# EAGLE design v0.3 (EAGLE 7.5.0)

## Sheet 1 of 2
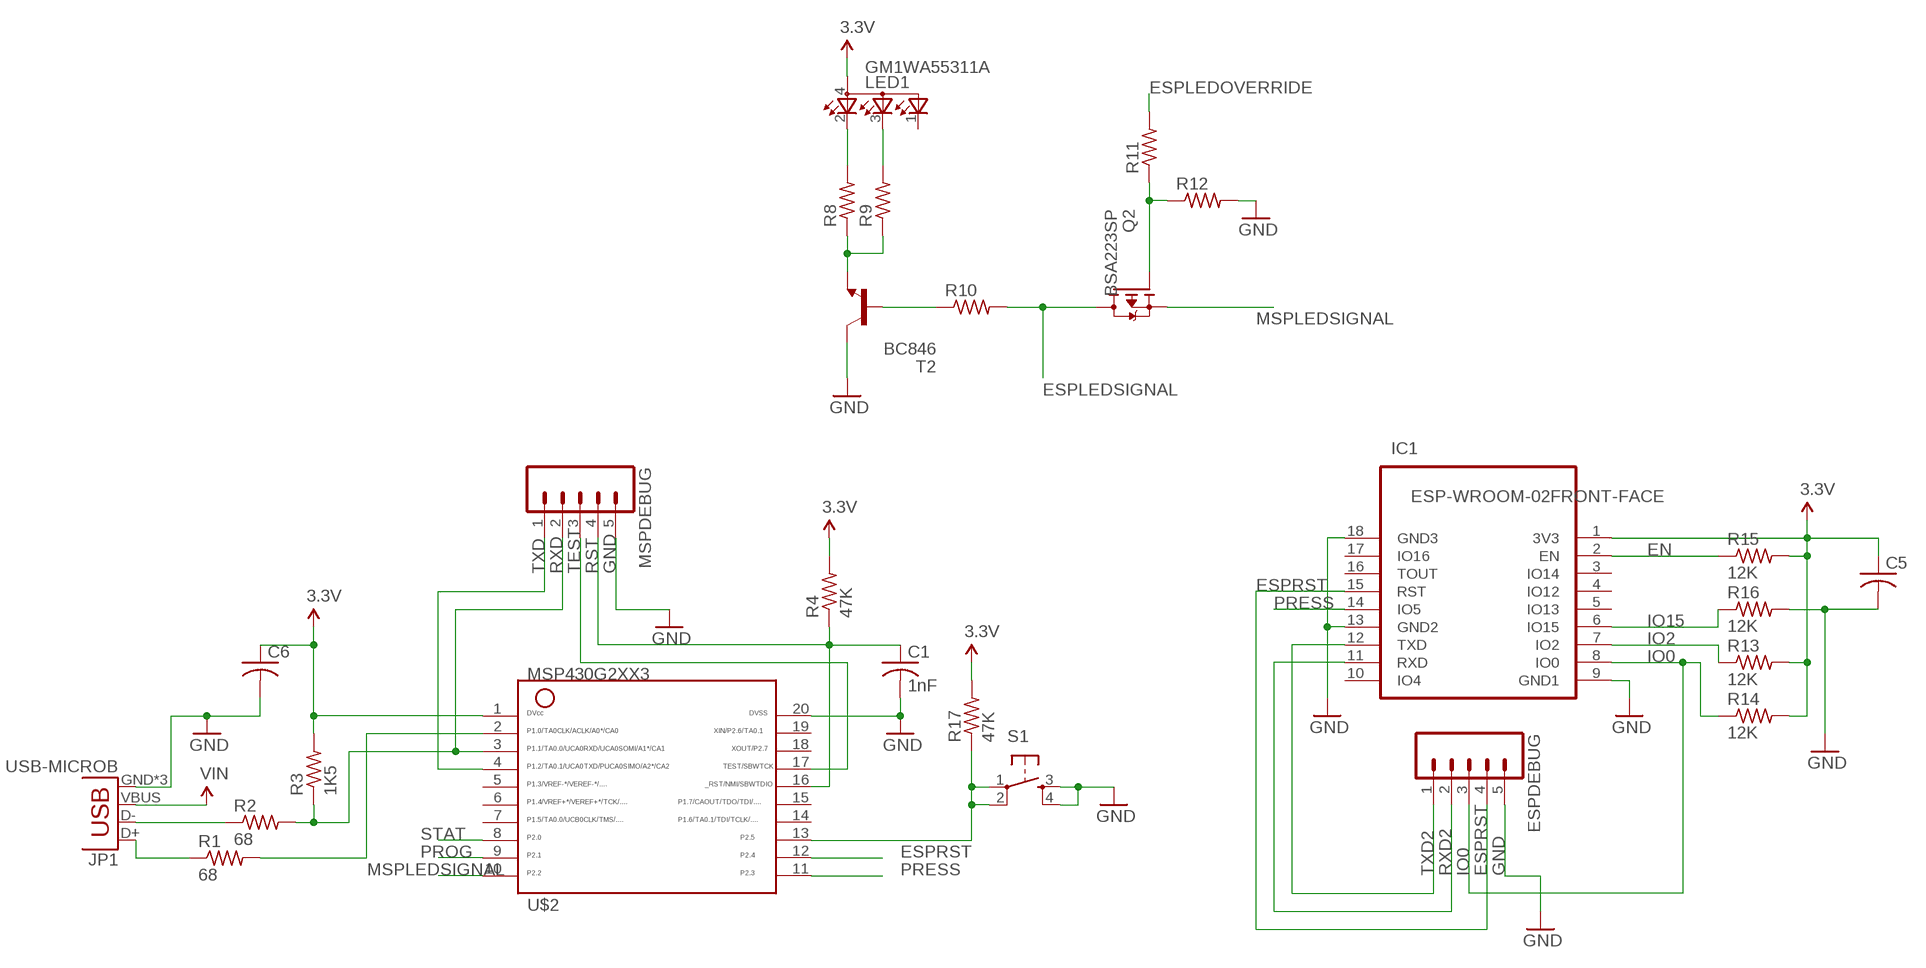
[diagram p0: schematic, sheet 1]

### Parts
C1  1nF  C-USC0603K  [C0603K]
C5  C-USC0603K  [C0603K]
C6  C-USC0603K  [C0603K]
ESPDEBUG  M05LOCK  [1X05_LOCK]
IC1  ESP-WROOM-02FRONT-FACE  [FRONT-FACE]
JP1  USB-MICROB  [USB-MICROB]
LED1  GM1WA55311A  [GM1WA55311A]
MSPDEBUG  M05LOCK  [1X05_LOCK]
Q2  BSA223SP  [SC75_INFINEON]
R1  68  R-US_R0603  [R0603]
R2  68  R-US_R0603  [R0603]
R3  1K5  R-US_R0603  [R0603]
R4  47K  R-US_R0603  [R0603]
R8  R-US_R0603  [R0603]
R9  R-US_R0603  [R0603]
R10  R-US_R0603  [R0603]
R11  R-US_R0603  [R0603]
R12  R-US_R0603  [R0603]
R13  12K  R-US_R0603  [R0603]
R14  12K  R-US_R0603  [R0603]
R15  12K  R-US_R0603  [R0603]
R16  12K  R-US_R0603  [R0603]
R17  47K  R-US_R0603  [R0603]
S1  TAC_SWITCHPTH  [TACTILE-PTH]
T2  BC846  [SOT23]
U$2  G2XX3---PW20  [PW20]

### Nets
3.3V: C5.1 C6.1 IC1.1(3V3) LED1.4(A) R3.2 R4.2 R13.2 R14.2 R15.2 R17.2 U$2.1 ; also sheet 2
EN: IC1.2(EN) R15.1
ESPLEDOVERRIDE: R11.2
ESPLEDSIGNAL: Q2.2(D) R10.2
ESPRST: ESPDEBUG.4 IC1.15(RST) U$2.12
GND: C1.2 C5.2 C6.2 ESPDEBUG.5 IC1.9(GND1) IC1.13(GND2) IC1.18(GND3) JP1.GND JP1.MT1(GND) JP1.MT2(GND) MSPDEBUG.5 R12.2 R16.2 S1.3 S1.4 T2.3(C) U$2.20 ; also sheet 2
IO0: ESPDEBUG.3 IC1.8(IO0) R14.1
IO2: IC1.7(IO2) R13.1
IO15: IC1.6(IO15) R16.1
MSPLEDSIGNAL: Q2.3(S) U$2.10
N$2: JP1.D+ R1.1
N$3: JP1.D- R2.1
N$4: R1.2 U$2.2
N$10: R17.1 S1.1 S1.2 U$2.13
N$13: LED1.2(CRED) R8.2
N$14: LED1.3(CBLUE) R9.2
N$15: R10.1 T2.1(B)
N$16: R8.1 R9.1 T2.2(E)
N$18: Q2.1(G) R11.1 R12.1
PRESS: IC1.14(IO5) U$2.11
PROG: U$2.9 ; also sheet 2
RST: C1.1 MSPDEBUG.4 R4.1 U$2.16
RXD: MSPDEBUG.2 R2.2 R3.1 U$2.3
RXD2: ESPDEBUG.2 IC1.11(RXD)
STAT: U$2.8 ; also sheet 2
TEST: MSPDEBUG.3 U$2.17
TXD: MSPDEBUG.1 U$2.4
TXD2: ESPDEBUG.1 IC1.12(TXD)
VIN: JP1.VBUS ; also sheet 2
Unconnected: IC1.3(IO14) IC1.4(IO12) IC1.5(IO13) IC1.10(IO4) IC1.16(TOUT) IC1.17(IO16) LED1.1(CGREEN) U$2.5 U$2.6 U$2.7 U$2.14 U$2.15 U$2.18 U$2.19

## Sheet 2 of 2
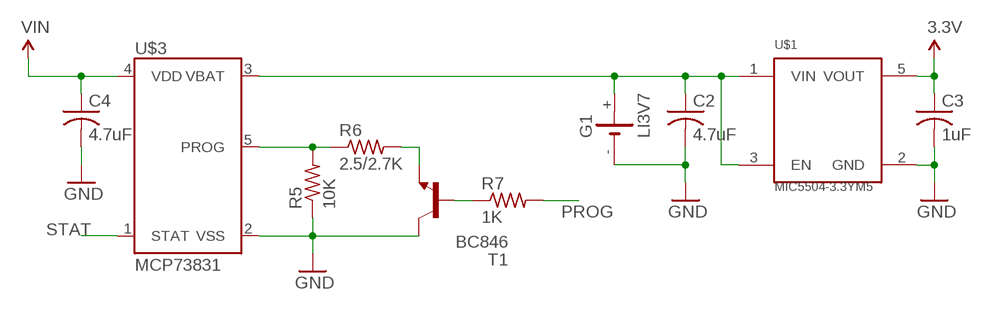
[diagram p1: schematic, sheet 2]

### Parts
C2  4.7uF  C-USC0603K  [C0603K]
C3  1uF  C-USC0603K  [C0603K]
C4  4.7uF  C-USC0603K  [C0603K]
G1  LI3V7  [LI3V7]
R5  10K  R-US_R0603  [R0603]
R6  2.5/2.7K  R-US_R0603  [R0603]
R7  1K  R-US_R0603  [R0603]
T1  BC846  [SOT23]
U$1  MIC5504-3.3YM5  [SOT23-5]
U$3  MCP73831  [SOT23-5]

### Nets
3.3V: C3.1 U$1.5(VOUT) ; also sheet 1
GND: C2.2 C3.2 C4.2 G1.- R5.1 T1.3(C) U$1.2(GND) U$3.2(VSS) ; also sheet 1
N$1: R5.2 R6.1 U$3.5(PROG)
N$7: C2.1 G1.+ U$1.1(VIN) U$1.3(EN) U$3.3(VBAT)
N$8: R6.2 T1.2(E)
N$9: R7.1 T1.1(B)
PROG: R7.2 ; also sheet 1
STAT: U$3.1(STAT) ; also sheet 1
VIN: C4.1 U$3.4(VDD) ; also sheet 1

## Library data of the parts
C1-C6 = rcl:C-US: CAPACITOR, American symbol
ESPDEBUG MSPDEBUG = SparkFun-Connectors:M05: Header 5 Standard 5-pin 0.1" header. Use with straight break away headers (SKU : PRT-00116), right angle break away headers (PRT-00553), swiss pins (PRT-00743), machine pins (PRT-00117), and female headers (PRT-00115). Molex polarized connector foot print use with SKU : PRT-08230 with associated crimp pins and housings.
G1 = battery:LI3V7
IC1 = esp-wroom-02:ESP-WROOM-02: WiFi module - ESP-WROOM-02
JP1 = SparkFun-Connectors:USB: USB Connectors USB-B-PTH is fully proven SKU : PRT-00139/CONN-08278 USB-miniB is fully proven SKU : PRT-00587 USB-A-PCB is untested. USB-A-H is throughly reviewed, but untested. Spark Fun Electronics SKU : PRT-00437 USB-B-SMT is throughly reviewed, but untested. Needs silkscreen touching up. USB-A-S has not been used/tested USB-MB-H has not been used/tested USB-MICROB has been used. CONN-09505; PROD_ID: CONN-09505
LED1 = led:GM1WA55311A: Chip LED RGB Source: http://document.sharpsma.com/files/GM1WA55311A_SS.pdf
Q2 = transistor-fet:BSA223SP: OptiMOS(R)-P Small-Signal-Transistor P-Channel, Enhancement mode, Super Logic Level (2.5 V rated) Source: http://www.infineon.com/upload/Document/BSA223SP_Rev1.3.pdf
R1-R17 = rcl:R-US_: RESISTOR, American symbol
S1 = SparkFun-Electromechanical:TAC_SWITCH: Momentary Switch Button commonly used for reset or general input. Spark Fun Electronics SKU : COM-00097 SMT- SWCH-08247
T1 T2 = transistor:BC846: NPN TRANSISTOR
U$1 = micrel:MIC5504-3.3YM5: MIC5504-3.3YM5
U$2 = TI_MSP430_v16:G2XX3---PW20: MSP430G2XX1 TSSOP (PW) 20 Pin Package
U$3 = GeekAmmo:MCP73831: MCP73831 Miniature Single-Cell, Fully Integrated Li-Ion, Li-Polymer Charge Management Controllers The MCP73831/2 devices are highly advanced linear charge management controllers for use in spacelimited, cost-sensitive applications. http://ww1.microchip.com/downloads/en/DeviceDoc/20001984F.pdf

## Board
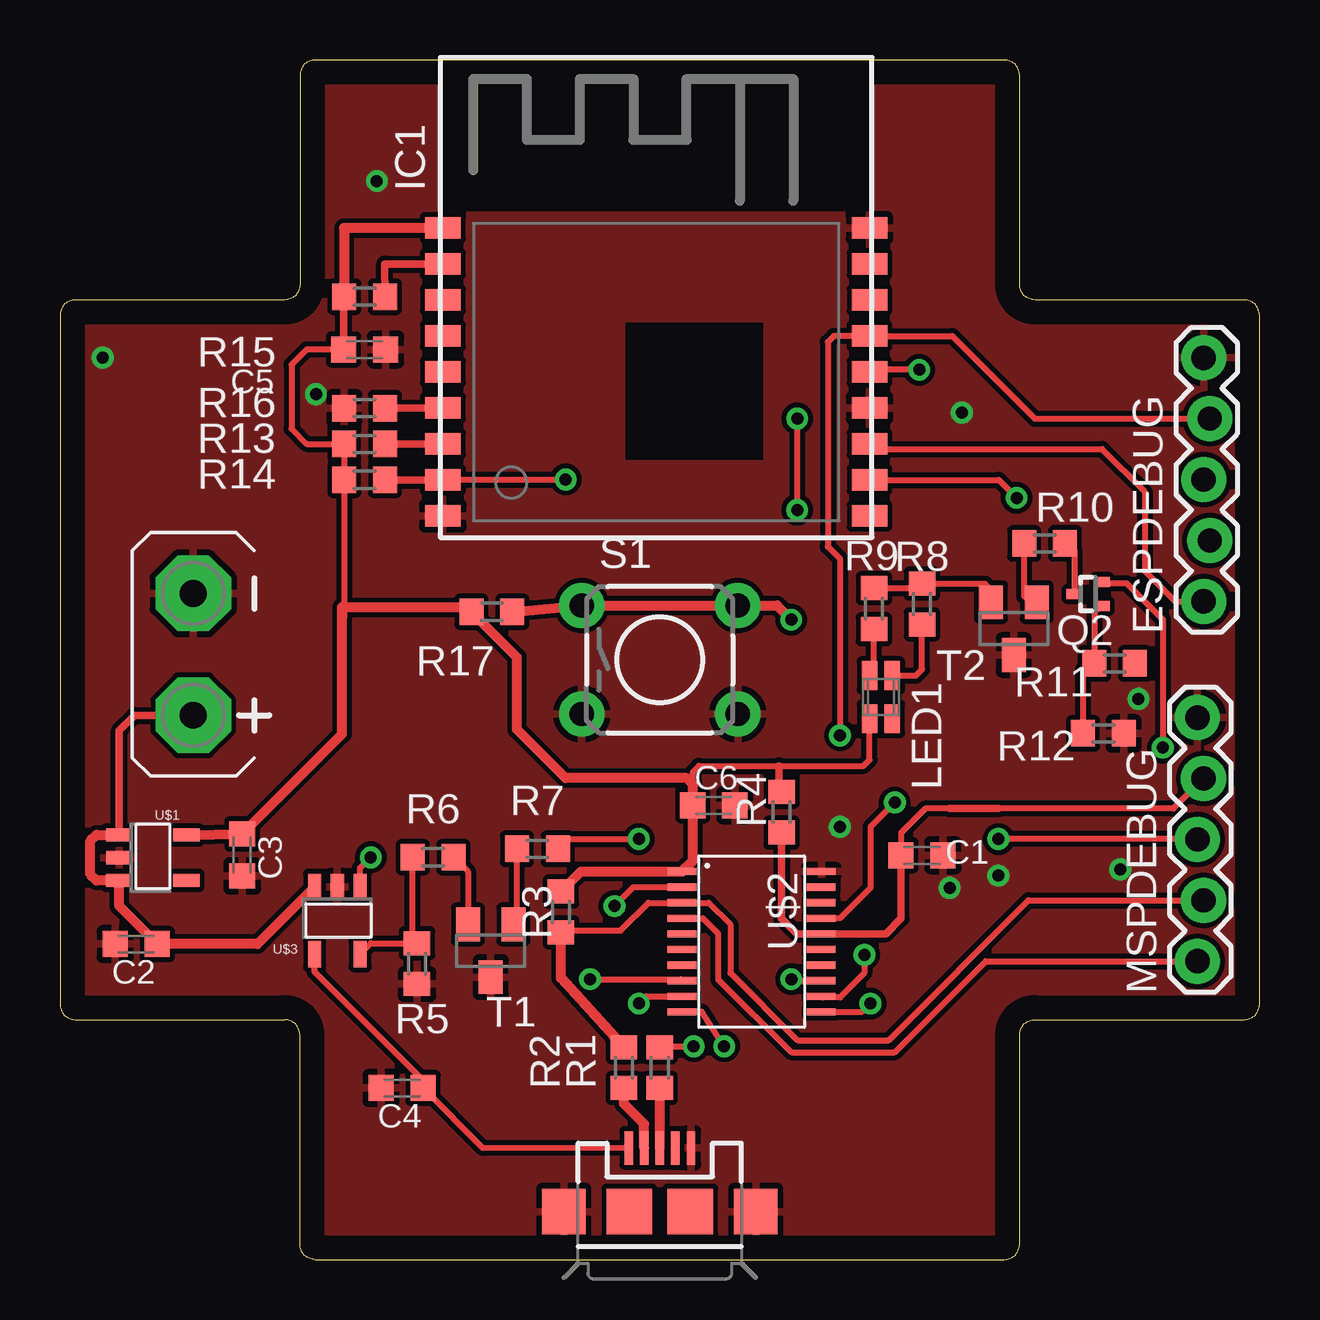
[diagram p2: board, top side]
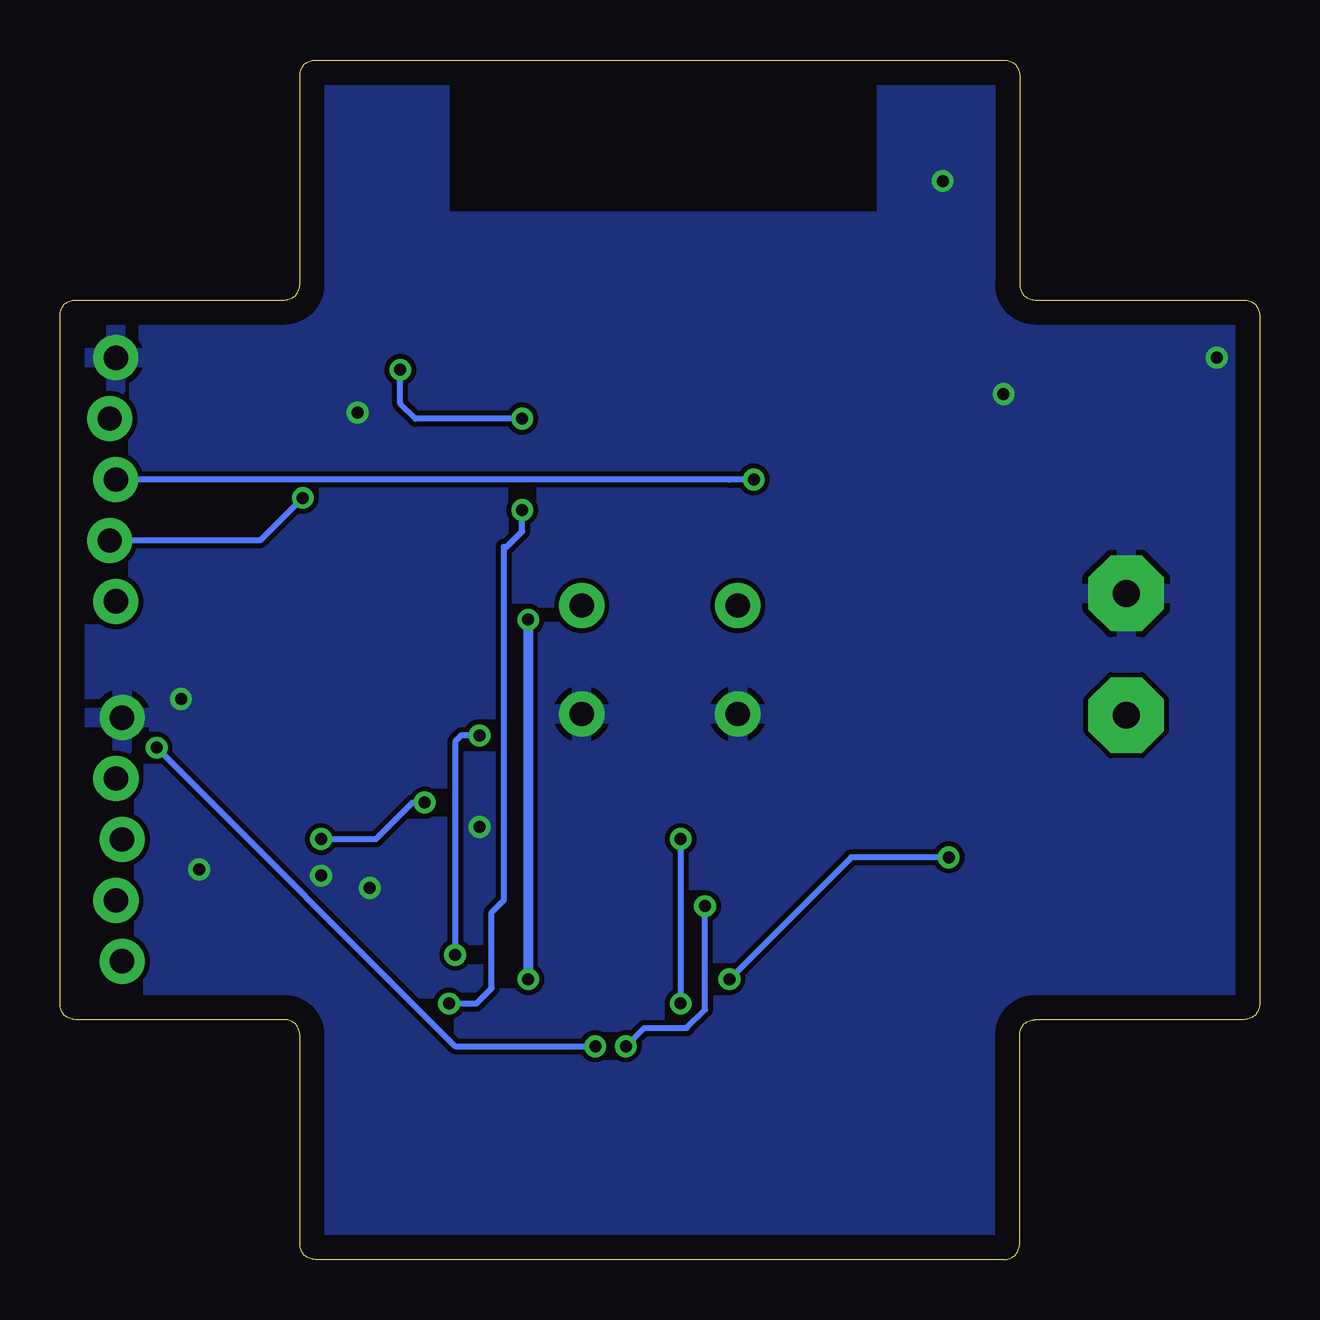
[diagram p3: board, bottom side, seen from below]

Size 50 x 50 mm. Coordinates in mm from the lower left corner, seen from the top.
Outline: 10.63,0 39.37,0 arc90 40,0.64 40,9.37 arc-90 40.63,10 49.37,10 arc90 50,10.63 50,39.37 arc90 49.37,40 40.63,40 arc-90 40,40.63 40,49.37 arc90 39.37,50 10.63,50 arc90 10,49.37 10,40.63 arc-90 9.37,40 0.64,40 arc90 0,39.37 0,10.63 arc90 0.64,10 9.37,10 arc-90 10,9.37 10,0.64 arc90 10.63,0
Copper layers (1*16): Top 0.035mm / dielectric 1.5mm / Bottom 0.035mm
Design rules "default": minimum track width 10mil, minimum drill 24mil, track to track 8mil, track to pad 8mil, pad to pad 8mil, via to via 8mil, smd to smd 8mil, copper to edge 40mil, drill to drill 8mil, minimum pad ring 10mil, minimum via ring 8mil, stop-mask expansion 4mil, vias tented up to drill 0mil, thermal gap 10mil

### Footprints (pad centres in the part's own frame; a part is rotated, then mirrored left to right if it is on the bottom)
C0603K = smd 1.05 x 1.08: 1 -0.875,0; 2 0.875,0
1X05_LOCK = drill 1.016 pad 1.88: 1 0,0.127; 2 2.54,-0.127; 3 5.08,0.127; 4 7.62,-0.127; 5 10.16,0.127
LI3V7 = drill 1.118 pad 3.15 octagon: + 0,2.54; - 0,-2.54
FRONT-FACE = smd 1.485 x 0.9: 1 -8.893,4.9; 2 -8.893,3.4; 3 -8.893,1.9; 4 -8.893,0.4; 5 -8.893,-1.1; 6 -8.893,-2.6; 7 -8.893,-4.1; 8 -8.893,-5.6; 9 -8.893,-7.1; 10 8.893,-7.1; 11 8.893,-5.6; 12 8.893,-4.1; 13 8.893,-2.6; 14 8.893,-1.1; 15 8.893,0.4; 16 8.893,1.9; 17 8.893,3.4; 18 8.893,4.9
USB-MICROB = smd 0.35 x 1.4: D+ 0,2.65; D- -0.65,2.65; GND 1.3,2.65; ID 0.65,2.65; VBUS -1.3,2.65 | smd 1.8 x 1.9: MT1 -4,0; MT2 4,0 | smd 1.9 x 1.9: P$1 -1.27,0; P$2 1.27,0
GM1WA55311A = smd 0.65 x 1.2: 1 -0.475,0.9; 2 -0.475,-0.9; 3 0.475,-0.9; 4 0.475,0.9
SC75_INFINEON = smd 0.4 x 0.65: 1 -0.5,-0.575; 2 0,0.575; 3 0.5,-0.575
R0603 = smd 1 x 1.1: 1 -0.85,0; 2 0.85,0
TACTILE-PTH = drill 1.016 pad 1.88: 1 -3.251,2.261; 2 3.251,2.261; 3 -3.251,-2.261; 4 3.251,-2.261
SOT23 = smd 1 x 1.4: 1 -0.95,-1.1; 2 0.95,-1.1; 3 0,1.1
SOT23-5 = smd 0.55 x 1.1: 1 -0.95,-1.3; 2 0,-1.3; 3 0.95,-1.3; 4 0.95,1.5; 5 -0.95,1.5
PW20 = smd 0.3 x 1.2: 1 -2.925,-2.9; 2 -2.275,-2.9; 3 -1.625,-2.9; 4 -0.975,-2.9; 5 -0.325,-2.9; 6 0.325,-2.9; 7 0.975,-2.9; 8 1.625,-2.9; 9 2.275,-2.9; 10 2.925,-2.9; 11 2.925,2.9; 12 2.275,2.9; 13 1.625,2.9; 14 0.975,2.9; 15 0.325,2.9; 16 -0.325,2.9; 17 -0.975,2.9; 18 -1.625,2.9; 19 -2.275,2.9; 20 -2.925,2.9

### Placement (x,y rotation side)
C1  35.93,16.85 0 top
C2  3.18,13.15 180 top
C3  7.6,16.86 270 top
C4  14.26,7.15 180 top
C5  12.7,37.93 0 top
C6  27.25,18.93 0 top
ESPDEBUG  47.8,27.43 90 top
G1  5.56,25.23 180 top
IC1  24.85,38.1 0 top
JP1  25,2 0 top
LED1  34.22,23.44 180 top
MSPDEBUG  47.54,12.43 90 top
Q2  42.85,27.74 90 top
R1  25,8 90 top
R2  23.51,8 90 top
R3  20.88,14.49 90 top
R4  30.08,18.65 90 top
R5  14.88,12.33 90 top
R6  15.55,16.77 0 top
R7  19.9,17.12 0 top
R8  35.93,27.32 270 top
R9  33.93,27.13 270 top
R10  41.04,29.85 0 top
R11  43.96,24.85 0 top
R12  43.49,21.93 0 top
R13  12.7,33.99 180 top
R14  12.7,32.5 180 top
R15  12.7,40.13 180 top
R16  12.7,35.48 180 top
R17  18,27 180 top
S1  25,25 0 top
T1  17.95,12.87 180 top
T2  39.76,26.3 180 top
U$1  3.77,16.75 270 top
U$2  28.83,13.25 270 top
U$3  11.56,14.23 180 top

### Tracks (layer width: path | path; a pad name or v marks a point on that pad's centre or on a via)
3.3V
  Top 0.254: R17.2 17.07,26.92 | 26.38,19.81 26.38,20.32 26.63,20.57 29.97,20.57 33.49,20.57 33.74,20.83 LED1.4 | C5.1 10.29,37.93 9.65,37.3 9.65,34.63 10.29,33.99 R13.2 R14.2 11.85,26.76 11.76,26.67
  Top 0.305: R4.2 arc-45 29.97,19.75 29.97,20.57 | C5.1 11.82,40.62 11.85,40.64
  Top 0.406: IC1.1 11.84,43 11.85,40.64 R15.2 | U$1.5 C3.1 11.76,21.9 11.76,26.67 11.76,27.18 16.82,27.18 17.07,26.92 | R3.2 21.71,16.18 U$2.1 26.38,16.62 C6.1 26.38,19.81 26.12,20.07 21.08,20.07 19.05,22.1 19.05,25.1 R17.2
EN
  Top 0.305: R15.1 13.54,41.5 IC1.2
ESPLEDSIGNAL
  Top 0.254: R10.2 42.02,29.85 42.27,29.6 Q2.2
ESPRST  (via drill 0.5)
  Top 0.254: v32.51,21.84 32.51,29.21 32,29.72 32,38.25 32.26,38.5 IC1.15 37.19,38.5 40.64,35.05 ESPDEBUG.4 | v33.53,12.7 33.53,11.94 32.51,10.92 31.78,10.92 U$2.12
  Bottom 0.254: v32.51,21.84 33.27,21.84 33.53,21.59 v33.53,12.7
GND  (via drill 0.5)
  other vias: 10.67,36.07 1.78,37.59 37.08,15.49 32.51,18.03 44.96,23.37 44.2,16.26 39.12,16 37.59,35.31 13.21,44.96
  pour Top: -1,-1 51,-1 51,51 -1,51
  pour Bottom: -1,-1 51,-1 51,51 -1,51
IO0  (via drill 0.5)
  Top 0.254: IC1.8 15.97,32.51 v21.08,32.51
  Top 0.305: R14.1 IC1.8
  Bottom 0.254: v21.08,32.51 22.1,32.51 ESPDEBUG.3
IO2
  Top 0.305: R13.1 IC1.7
IO15
  Top 0.305: 13.62,35.5 IC1.6
  Top 0.813: R16.1 13.62,35.5
MSPLEDSIGNAL  (via drill 0.5)
  Top 0.254: Q2.3 43.47,28.19 44.45,28.19 45.97,26.67 v45.97,21.34 | v27.69,8.89 26.76,10.32 U$2.10
  Bottom 0.254: v45.97,21.34 33.53,8.89 v27.69,8.89
N$1
  Top 0.254: U$3.5 12.96,13.18 R5.2 14.7,13.36 R6.1
N$2
  Top 0.406: JP1.D+ R1.1
N$3
  Top 0.406: JP1.D- 24.35,5.65 23.51,6.49 R2.1
N$4  (via drill 0.5)
  Top 0.254: R1.2 25.04,8.89 v26.42,8.89 | v23.11,14.73 23.91,15.53 U$2.2
  Bottom 0.254: v26.42,8.89 25.65,9.65 23.88,9.65 23.11,10.41 v23.11,14.73
N$7
  Top 0.305: U$1.1 2.47,22.05 3.1,22.69 G1.+
  Top 0.406: U$3.3 8.23,13.15 C2.1 2.47,14.73 U$1.3 1.52,15.8 1.27,16.05 1.27,17.45 1.52,17.7 U$1.1
N$8
  Top 0.254: R6.2 17,16.17 T1.2
N$9
  Top 0.254: T1.1 19.05,14.12 R7.1
N$10  (via drill 0.5)
  Top 0.254: v30.48,11.68 30.54,11.62 U$2.13
  Top 0.406: R17.1 S1.1 S1.2 29.89,27.26 v30.48,26.67
  Bottom 0.406: v30.48,26.67 v30.48,11.68
N$13
  Top 0.254: LED1.2 35.68,24.34 35.93,24.59 R8.2
N$14
  Top 0.254: LED1.3 33.93,24.52 R9.2
N$15
  Top 0.254: T2.1 40.44,27.4 40.19,27.65 R10.1
N$16
  Top 0.254: R9.1 35.74,27.98 R8.1 38.56,28.17 38.81,27.92 T2.2
N$18
  Top 0.254: Q2.1 43.36,27.24 43.11,26.99 R11.1 42.89,24.85 42.64,24.6 R12.1
PRESS  (via drill 0.5)
  Top 0.254: U$2.11 33.44,10.32 v33.78,10.67 | v30.73,31.24 v30.73,35.05 | v35.81,37.08 33.83,37.08 IC1.14
  Bottom 0.254: v33.78,10.67 32.64,10.67 32,11.3 32,14.48 31.5,14.99 31.5,29.72 31.37,29.72 30.73,30.35 v30.73,31.24 | v30.73,35.05 35.18,35.05 35.81,35.69 v35.81,37.08
PROG  (via drill 0.5)
  Top 0.254: R7.2 20.85,17.02 20.83,17.02 20.83,17.53 v24.13,17.53 | v24.13,10.67 24.44,10.97 U$2.9
  Bottom 0.254: v24.13,17.53 v24.13,10.67
RST
  Top 0.254: MSPDEBUG.4 46.41,18.8 39.12,18.8 | 37.08,18.8 36.07,18.8 35.05,17.78 C1.1
  Top 0.305: R4.1 30.08,14.21 30.71,13.57 U$2.16 34.42,13.57 35.05,14.21 C1.1 | 37.08,18.8 39.12,18.8
RXD
  Top 0.254: R3.1 20.96,13.72 23.37,13.72 24.53,14.88 U$2.3 27.04,14.88 27.94,13.97 27.94,11.94 30.73,9.14 34.54,9.14 40.37,14.97 MSPDEBUG.2
  Top 0.406: R2.2 20.88,11.73 R3.1
RXD2  (via drill 0.5)
  Top 0.254: IC1.11 39.13,32.5 v39.88,31.75
  Bottom 0.254: v39.88,31.75 41.66,29.97 ESPDEBUG.2
STAT  (via drill 0.5)
  Top 0.254: U$3.1 12.51,16.32 v12.95,16.76 | v22.1,11.68 25.87,11.68 U$2.8
  Bottom 0.254: v12.95,16.76 17.02,16.76 v22.1,11.68
TEST  (via drill 0.5)
  Top 0.254: MSPDEBUG.3 47.4,17.53 v39.12,17.53 | v34.8,19.05 33.78,18.03 33.78,15.49 32.51,14.22 U$2.17
  Bottom 0.254: v39.12,17.53 36.83,17.53 35.31,19.05 v34.8,19.05
TXD
  Top 0.254: U$2.4 26.8,14.22 27.43,13.59 27.43,11.68 30.48,8.64 34.8,8.64 38.59,12.43 MSPDEBUG.1
TXD2
  Top 0.254: IC1.12 33.96,33.78 43.43,33.78 45.21,32 45.21,28.7 46.48,27.43 ESPDEBUG.1
VIN
  Top 0.254: JP1.VBUS 17.64,4.64 C4.1 15.13,7.47 10.61,12 U$3.4